# Altium project Flybuck.PrjPcb
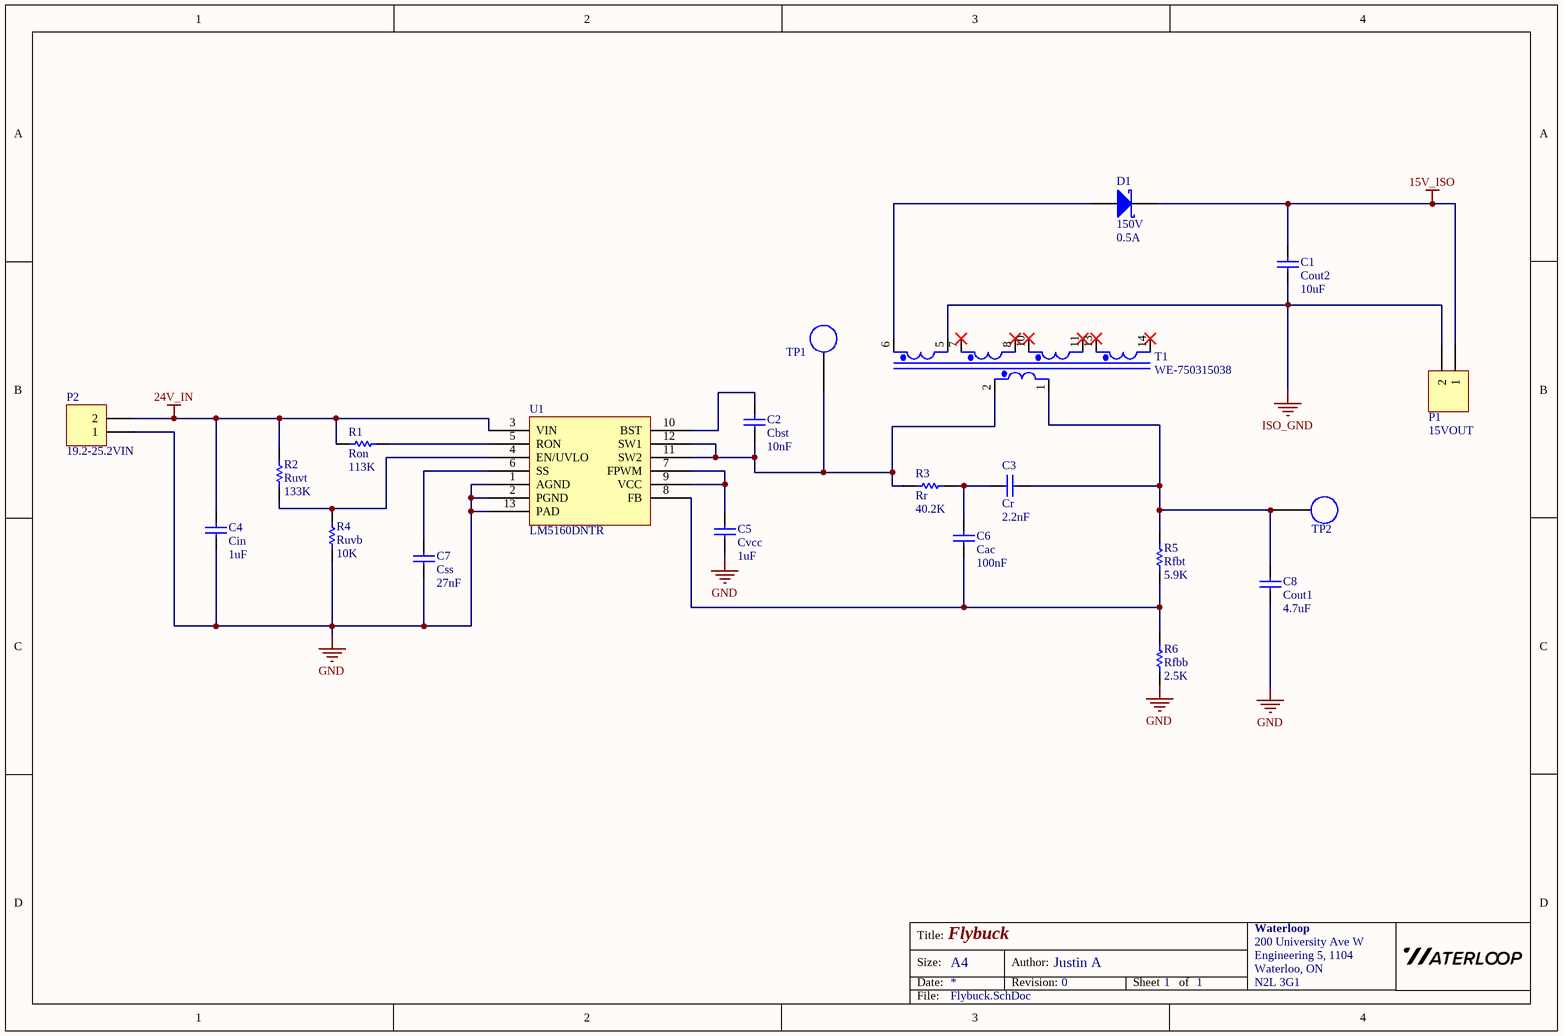
[diagram p0: Flybuck.SchDoc]
1 sheet, 21 parts. Net scope: global (net labels, ports and power ports of the same name join across sheets).
Board file: Flybuck.PcbDoc

## Sheet Flybuck.SchDoc: Flybuck
size A4; Author: Justin A; Organization: Waterloop; Address1: 200 University Ave W; Address2: Engineering 5, 1104; Address3: Waterloo, ON; Address4: N2L 3G1; Revision: 0; SheetNumber: 1; SheetTotal: 1

### Parts
C1  Cout2  value 10uF  [0805 - Capacitor]
C2  Cbst  value 10nF  [0805 - Capacitor]
C3  Cr  value 2.2nF  [0805 - Capacitor]
C4  Cin  value 1uF  [0805 - Capacitor]
C5  Cvcc  value 1uF  [0805 - Capacitor]
C6  Cac  value 100nF  [0805 - Capacitor]
C7  Css  value 27nF  [0805 - Capacitor]
C8  Cout1  value 4.7uF  [0805 - Capacitor]
D1  value 0.5A  Rating: 150V  [SOD123 - DIODE]  (hidden comment: Diode - Schottky)
P1  15VOUT  [HDR1X2]
P2  19.2-25.2VIN  [HDR1X2]
R1  Ron  value 113K  [0603 - Resistor]
R2  Ruvt  value 133K  [0603 - Resistor]
R3  Rr  value 40.2K  [0603 - Resistor]
R4  Ruvb  value 10K  [0603 - Resistor]
R5  Rfbt  value 5.9K  [0603 - Resistor]
R6  Rfbb  value 2.5K  [0603 - Resistor]
T1  WE-750315038  [WE-750315038]
TP1  Test Point  [Test Point]  (value not drawn)  (no BOM)
TP2  Test Point  [Test Point]  (value not drawn)  (no BOM)
U1  LM5160DNTR  [LM5160DNTR]

### Nets
15V_ISO: C1.2 D1.2(K) P1.1
24V_IN: C4.2 P2.2 R1.1 R2.2 U1.3(VIN)
GND: C4.1 C5.1 C7.1 C8.1 P2.1 R4.1 R6.1 U1.1(AGND) U1.2(PGND) U1.13(PAD)
ISO_GND: C1.1 P1.2 T1.5(Sec-)
NetC2_1: C2.1 R3.1 T1.2(Pri+) TP1.0 U1.11(SW2) U1.12(SW1)
NetC2_2: C2.2 U1.10(BST)
NetC3_1: C3.1 C8.2 R5.2 T1.1(Pri-) TP2.0
NetC3_2: C3.2 C6.2 R3.2
NetC5_2: C5.2 U1.7(FPWM) U1.9(VCC)
NetC6_1: C6.1 R5.1 R6.2 U1.8(FB)
NetC7_2: C7.2 U1.6(SS)
NetD1_1: D1.1(A) T1.6(Sec+)
NetR1_2: R1.2 U1.5(RON)
NetR2_1: R2.1 R4.2 U1.4(EN/UVLO)

Not connected (* = marked no-connect by the designer): T1 7(Sec+)* 8(Sec-)* 10(Sec+)* 11(Sec-)* 13(Sec+)* 14(Sec-)*

### Notes on the sheet
- Title:
- Size:
- Date:
- A4
- Author:
- Revision:
- Sheet
- of
- File:

### Library data of the parts
C1-C8 = Capacitor - Nonpolarized: Nonpolarized Capacitor; Supplier Part Number: *; Supplier: *; Manufacturer: *; Rating: *; Manufacturer Part Number: *
D1 = Diode - Schottky: Schottky Rectifier; Supplier Part Number: *; Supplier: *; Manufacturer: *; ComponentLink1Description: Manufacturer Link; ComponentLink1URL: http://www.irf.com/; ComponentLink2Description: Datasheet; ComponentLink2URL: http://www.irf.com/product-info/datasheets/data/10tq.pdf
P1 P2 = 1x2 Header: 1x2 Pin Header
R1-R6 = Resistor: Rating: *; Manufacturer Part Number: *; Manufacturer: *; Supplier Part Number: *; Supplier: *
T1 = WE-750315038: TRANSFORMER 36.5uH 300mA THT 26VDC; Manufacturer: Würth Elektronik; Datasheet: https://www.we-online.com/catalog/datasheet/750315038.pdf; Manufacturer Part Number: 750315038; Supplier Part Number: 1297-1155-ND; Supplier: Digikey
TP1 TP2 = Test Point: Test Point!
U1 = LM5160DNTR: IC REG BUCK FLYBCK ADJ 12WSON; Manufacturer: Texas Instruments; Datasheet: https://www.ti.com/lit/ds/symlink/lm5160.pdf?HQS=TI-null-null-digikeymode-df-pf-null-wwe&ts=1605241040592; Manufacturer Part Number: LM5160DNTR; Supplier Part Number: 296-46122-1-ND; Supplier: Digikey